# EAGLE design esp8266_esp12 (EAGLE 6.5.0)
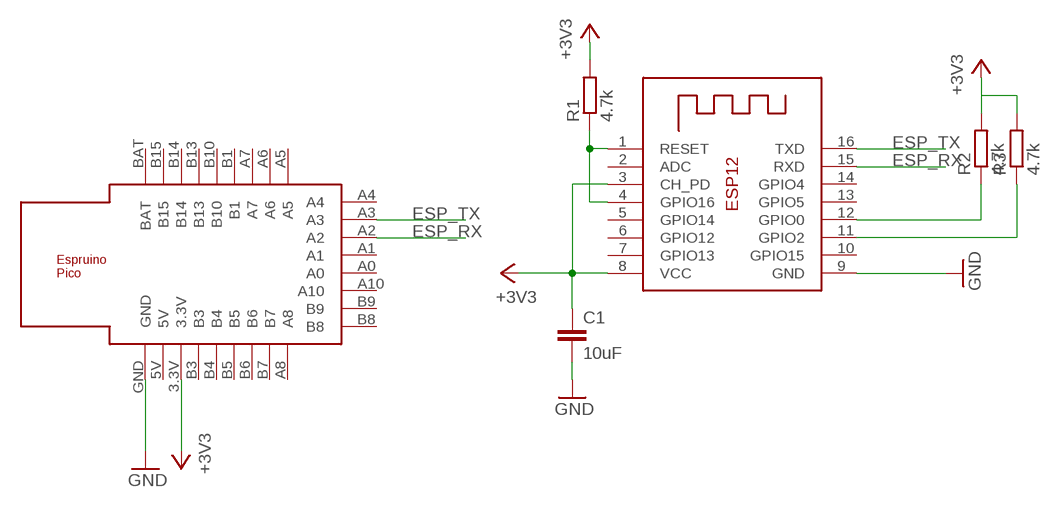
[diagram p0: schematic, sheet 1]

## Parts
C1  10uF  C-EUC1206  [C1206]
R1  4.7k  R-EU_R1206  [R1206]
R2  4.7k  R-EU_R1206  [R1206]
R3  4.7k  R-EU_R1206  [R1206]
U$1  ESPRUINO_PICO_HALFSMD  [ESPRUINO_PICO_HALFSMD]
X1  ESP-12  [ESP-12]

## Nets
+3V3: C1.1 R1.2 R2.2 R3.2 U$1.3.3V X1.3(CH_PD) X1.8(VCC)
ESP_RX: U$1.A2 X1.15(RXD)
ESP_TX: U$1.A3 X1.16(TXD)
GND: C1.2 U$1.GND X1.9(GND)
N$1: R3.1 X1.11(GPIO2)
N$2: R2.1 X1.12(GPIO0)
N$9: R1.1 X1.1(RESET) X1.4(GPIO16)
Unconnected: U$1.5V U$1.A0 U$1.A1 U$1.A4 U$1.A5 U$1.A6 U$1.A7 U$1.A8 U$1.A10 U$1.B1 U$1.B3 U$1.B4 U$1.B5 U$1.B6 U$1.B7 U$1.B8 U$1.B9 U$1.B10 U$1.B13 U$1.B14 U$1.B15 U$1.BAT X1.2(ADC) X1.5(GPIO14) X1.6(GPIO12) X1.7(GPIO13) X1.10(GPIO15) X1.13(GPIO5) X1.14(GPIO4)

## Library data of the parts
C1 = rcl:C-EU: CAPACITOR, European symbol
R1-R3 = rcl:R-EU_: RESISTOR, European symbol
U$1 = espruino_pico:ESPRUINO_PICO_HALFSMD
X1 = adafruit:ESP-12

## Net classes
0 default: width 0.305 mm

## Board
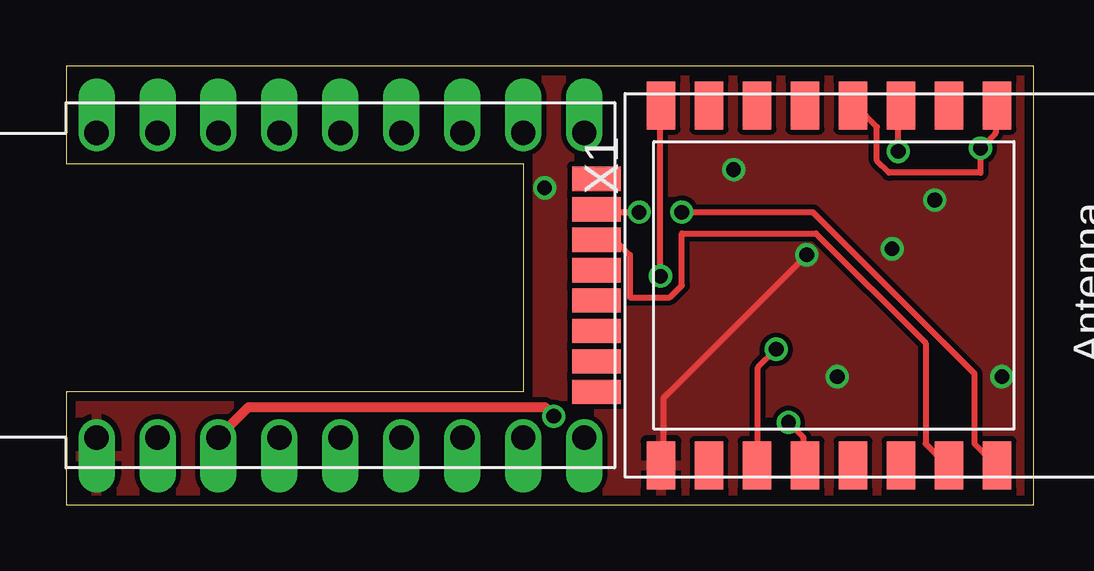
[diagram p1: board, top side]
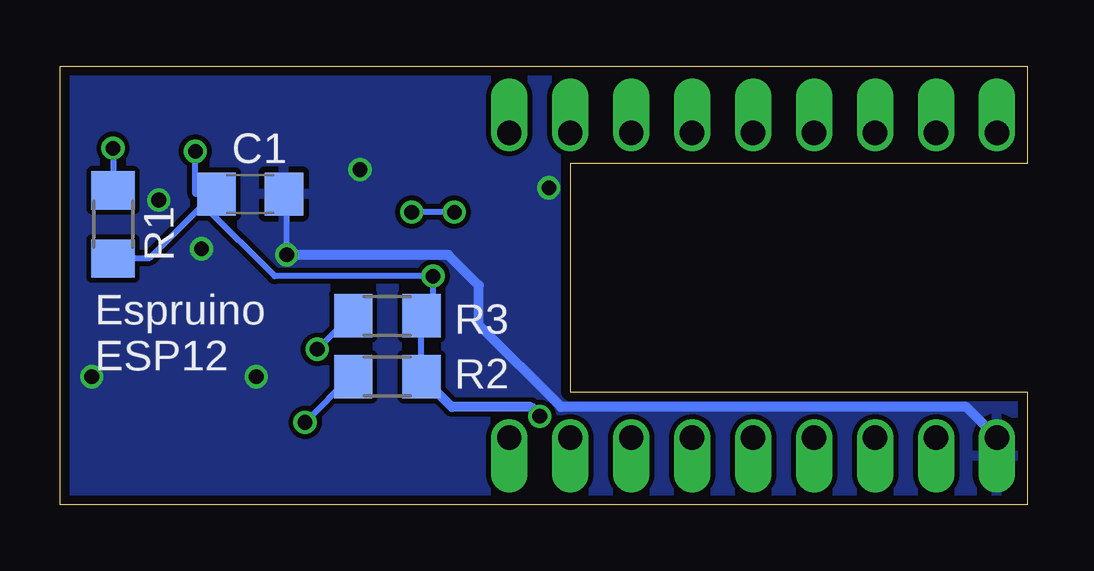
[diagram p2: board, bottom side, seen from below]

Size 40.31 x 18.28 mm. Coordinates in mm from the lower left corner, seen from the top.
Outline: 0,0 40.31,0 40.31,18.28 0,18.28 0,14.22 19.05,14.22 19.05,4.7 0,4.7 0,0
Copper layers (1*16): Top 0.0356mm / dielectric 1.5011mm / Bottom 0.0356mm
Design rules "oshpark *": minimum track width 10mil, minimum drill 13mil, track to track 8mil, track to pad 6mil, pad to pad 6mil, via to via 6mil, smd to smd 6mil, copper to edge 15mil, drill to drill 6mil, minimum pad ring 7mil, minimum via ring 7mil, stop-mask expansion 4mil, vias tented up to drill 25mil, thermal gap 10mil

### Footprints (pad centres in the part's own frame; a part is rotated, then mirrored left to right if it is on the bottom)
C1206 = smd 1.6 x 1.8: 1 -1.4,0; 2 1.4,0
R1206 = smd 1.6 x 1.803: 1 -1.422,0; 2 1.422,0
ESPRUINO_PICO_HALFSMD = drill 1.016 offset: 3.3V -7.62,-6.35; 5V -10.16,-6.35; A5 7.62,6.35; A6 5.08,6.35; A7 2.54,6.35; A8 7.62,-6.35; B1 0,6.35; B3 -5.08,-6.35; B4 -2.54,-6.35; B5 0,-6.35; B6 2.54,-6.35; B7 5.08,-6.35; B10 -2.54,6.35; B13 -5.08,6.35; B14 -7.62,6.35; B15 -10.16,6.35; BAT -12.7,6.35; GND -12.7,-6.35 | smd 2.032 x 1.016: A0 8.128,-0.635; A1 8.128,0.635; A2 8.128,1.905; A3 8.128,3.175; A4 8.128,4.445; A10 8.128,-1.905; B8 8.128,-4.445; B9 8.128,-3.175
ESP-12 = smd 2 x 1.2: 1 -7.5,4.5; 2 -7.5,2.5; 3 -7.5,0.5; 4 -7.5,-1.5; 5 -7.5,-3.5; 6 -7.5,-5.5; 7 -7.5,-7.5; 8 -7.5,-9.5; 9 7.5,-9.5; 10 7.5,-7.5; 11 7.5,-5.5; 12 7.5,-3.5; 13 7.5,-1.5; 14 7.5,0.5; 15 7.5,2.5; 16 7.5,4.5

### Placement (x,y rotation side)
C1  32.38,12.95 0 bottom
R1  38.1,11.68 270 bottom
R2  26.67,5.33 0 bottom
R3  26.67,7.87 0 bottom
U$1  13.97,9.14 0 top
X1  34.29,9.14 270 top

### Tracks (layer width: path | path; a pad name or v marks a point on that pad's centre or on a via)
+3V3  (via drill 0.61)
  Top 0.254: v34.67,14.73 34.67,16.64 X1.3 | v24.77,9.53 24.77,16.64 X1.8
  Top 0.406: U$1.3.3V 7.62,4.06 19.94,4.06 v20.32,3.68
  Bottom 0.254: C1.1 33.91,12.95 36.58,10.29 38.1,10.29 R1.2 | v34.67,14.73 34.67,12.95 C1.1 | R2.2 25.27,5.33 25.27,7.87 R3.2 24.77,7.87 v24.77,9.53 31.37,9.53 34.29,12.45 C1.1
  Bottom 0.406: v20.32,3.68 20.7,4.06 23.98,4.06 R2.2
ESP_RX
  Top 0.254: U$1.A2 22.86,11.05 23.5,10.41 23.5,8.64 25.15,8.64 25.65,9.14 25.65,11.3 31.24,11.3 35.81,6.73 35.81,2.54 36.7,1.65 X1.15
ESP_TX  (via drill 0.61)
  Top 0.254: v25.65,12.19 31.11,12.19 37.85,5.46 37.85,2.54 38.73,1.65 X1.16 | v23.88,12.19 22.1,12.19 U$1.A3
  Bottom 0.254: v23.88,12.19 v25.65,12.19
GND  (via drill 0.61)
  Top 0.254: v30.86,10.41 24.89,4.45 24.89,1.65 X1.9
  Bottom 0.254: v30.86,10.41 30.86,12.95 C1.2
  Bottom 0.406: U$1.GND 2.54,4.06 19.43,4.06 22.86,7.49 22.86,9.14 24.13,10.41 v30.86,10.41
  other vias: 32.13,5.33 38.99,5.33 34.42,10.67 36.2,12.7 27.81,13.97 19.94,13.21
  pour Bottom: -1.27,19.05 41.91,19.05 41.91,-1.27 -1.27,-1.27
  pour Top: -1.27,19.05 41.91,19.05 41.91,-1.27 -1.27,-1.27
N$1  (via drill 0.61)
  Top 0.254: v29.59,6.48 28.83,5.71 28.83,1.65 X1.11
  Bottom 0.254: v29.59,6.48 28.19,7.87 R3.1
N$2  (via drill 0.61)
  Top 0.254: v30.1,3.43 30.73,2.79 30.73,1.65 X1.12
  Bottom 0.254: v30.1,3.43 28.19,5.33 R2.1
N$9  (via drill 0.61)
  Top 0.254: X1.1 38.73,16.64 38.73,15.49 v38.1,14.86 38.1,13.84 34.29,13.84 33.78,14.35 33.78,15.75 32.89,16.64 X1.4
  Bottom 0.254: v38.1,14.86 R1.1

### Text on the board
bNames: Espruino / ESP12